# Altium project 1U 按键.PrjPcb
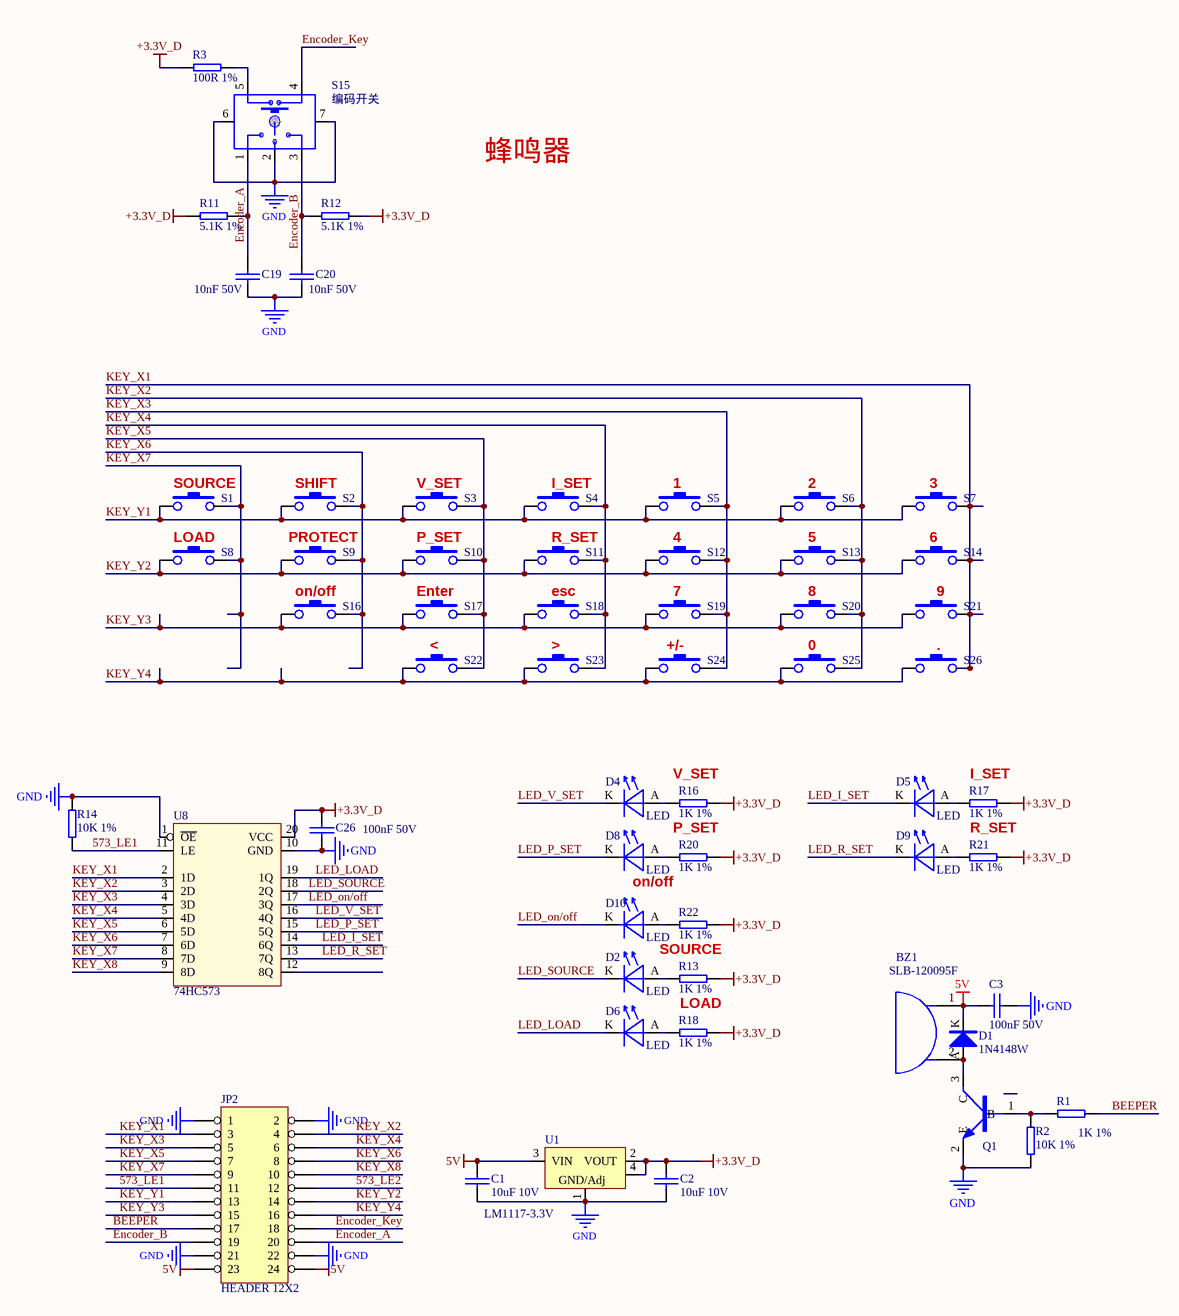
[diagram p0: 1U 按键.SchDoc]
1 sheet, 58 parts. Net scope: global (net labels, ports and power ports of the same name join across sheets).
Board file: 1U 按键.PcbDoc

## Sheet 1U 按键.SchDoc
size A3

### Parts
BZ1  SLB-120095F  [BEEP12]
C1  10uF 10V  [C0603]
C2  10uF 10V  [C0603]
C3  100nF 50V  [C0603]
C19  10nF 50V  [C0603]
C20  10nF 50V  [C0603]
C26  100nF 50V  [C0603]
D1  1N4148W  [SOD-123]
D2  LED  [LED1206]
D4  LED  [LED1206]
D5  LED  [LED1206]
D6  LED  [LED1206]
D8  LED  [LED1206]
D9  LED  [LED1206]
D10  LED  [LED1206]
JP2  HEADER 12X2  [FPC-SMD_P0.50-24P_H2.0]
Q1  S8050  [SOT-23]  (value not drawn)
R1  1K 1%  [R0603]
R2  10K 1%  [R0603]
R3  100R 1%  [R0603]
R11  5.1K 1%  [R0603]
R12  5.1K 1%  [R0603]
R13  1K 1%  [R0603]
R14  10K 1%  [R0603]
R16  1K 1%  [R0603]
R17  1K 1%  [R0603]
R18  1K 1%  [R0603]
R20  1K 1%  [R0603]
R21  1K 1%  [R0603]
R22  1K 1%  [R0603]
S1  SW-PB  [SW-SMD2]  (value not drawn)
S2  SW-PB  [SW-SMD3]  (value not drawn)
S3  SW-PB  [SW-SMD2]  (value not drawn)
S4  SW-PB  [SW-SMD2]  (value not drawn)
S5  SW-PB  [SW-SMD3]  (value not drawn)
S6  SW-PB  [SW-SMD3]  (value not drawn)
S7  SW-PB  [SW-SMD3]  (value not drawn)
S8  SW-PB  [SW-SMD2]  (value not drawn)
S9  SW-PB  [SW-SMD3]  (value not drawn)
S10  SW-PB  [SW-SMD2]  (value not drawn)
S11  SW-PB  [SW-SMD2]  (value not drawn)
S12  SW-PB  [SW-SMD3]  (value not drawn)
S13  SW-PB  [SW-SMD3]  (value not drawn)
S14  SW-PB  [SW-SMD3]  (value not drawn)
S15  编码开关  [EC-11]
S16  SW-PB  [SW-SMD2]  (value not drawn)
S17  SW-PB  [SW-SMD3]  (value not drawn)
S18  SW-PB  [SW-SMD3]  (value not drawn)
S19  SW-PB  [SW-SMD3]  (value not drawn)
S20  SW-PB  [SW-SMD3]  (value not drawn)
S21  SW-PB  [SW-SMD3]  (value not drawn)
S22  SW-PB  [SW-SMD3]  (value not drawn)
S23  SW-PB  [SW-SMD3]  (value not drawn)
S24  SW-PB  [SW-SMD3]  (value not drawn)
S25  SW-PB  [SW-SMD3]  (value not drawn)
S26  SW-PB  [SW-SMD3]  (value not drawn)
U1  LM1117-3.3V  [SOT-223]
U8  74HC573  [TSSOP-20]

### Nets
5V: BZ1.1 C1.1 C3.1 D1.K JP2.23 JP2.24 U1.3(VIN)
+3.3V_D: C2.1 C26.1 R3.1 R11.1 R12.2 R13.2 R16.2 R17.2 R18.2 R20.2 R21.2 R22.2 U1.2(VOUT) U1.4 U8.20(VCC)
GND: C1.2 C2.2 C3.2 C19.1 C20.1 C26.2 JP2.1 JP2.2 JP2.21 JP2.22 Q1.2(E) R2.1 R14.2 S15.2 S15.6 S15.7 U1.1(GND/Adj) U8.1(~{OE}) U8.10(GND)
573_LE1: JP2.11 R14.1 U8.11(LE)
573_LE2: JP2.12
BEEPER: JP2.17 R1.2
Encoder_A: C19.2 JP2.20 R11.2 S15.1
Encoder_B: C20.2 JP2.19 R12.1 S15.3
Encoder_Key: JP2.18 S15.4
KEY_X1: JP2.3 S7.2 S14.2 S21.2 S26.2 U8.2(1D)
KEY_X2: JP2.4 S6.2 S13.2 S20.2 S25.2 U8.3(2D)
KEY_X3: JP2.5 S5.2 S12.2 S19.2 S24.2 U8.4(3D)
KEY_X4: JP2.6 S4.2 S11.2 S18.2 S23.2 U8.5(4D)
KEY_X5: JP2.7 S3.2 S10.2 S17.2 S22.2 U8.6(5D)
KEY_X6: JP2.8 S2.2 S9.2 S16.2 U8.7(6D)
KEY_X7: JP2.9 S1.2 S8.2 U8.8(7D)
KEY_X8: JP2.10 U8.9(8D)
KEY_Y1: JP2.13 S1.1 S2.1 S3.1 S4.1 S5.1 S6.1 S7.1
KEY_Y2: JP2.14 S8.1 S9.1 S10.1 S11.1 S12.1 S13.1 S14.1
KEY_Y3: JP2.15 S16.1 S17.1 S18.1 S19.1 S20.1 S21.1
KEY_Y4: JP2.16 S22.1 S23.1 S24.1 S25.1 S26.1
LED_I_SET: D5.K U8.14(6Q)
LED_LOAD: D6.K U8.19(1Q)
LED_on/off: D10.K U8.17(3Q)
LED_P_SET: D8.K U8.15(5Q)
LED_R_SET: D9.K U8.13(7Q)
LED_SOURCE: D2.K U8.18(2Q)
LED_V_SET: D4.K U8.16(4Q)
NetBZ1_2: BZ1.2 D1.A Q1.3(C)
NetD2_A: D2.A R13.1
NetD4_A: D4.A R16.1
NetD5_A: D5.A R17.1
NetD6_A: D6.A R18.1
NetD8_A: D8.A R20.1
NetD9_A: D9.A R21.1
NetD10_A: D10.A R22.1
NetQ1_1: Q1.1(B) R1.1 R2.2
NetR3_2: R3.2 S15.5

Not connected (* = marked no-connect by the designer): U8 12(8Q)

### Notes on the sheet
- 蜂鸣器
- (near S1) SOURCE
- (near S2) SHIFT
- (near S3) V_SET
- (near S4) I_SET
- (near S5) 1
- (near S6) 2
- (near S7) 3
- LOAD
- PROTECT
- P_SET
- R_SET
- 4
- 5
- 6
- on/off
- Enter
- esc
- 7
- 8
- 9
- <
- >
- +/-
- 0
- .
- V_SET
- (near R17) I_SET
- SOURCE

### Library data of the parts
BZ1 = Buzzer: UNIT: 110101900023X; UNIT-TYPE: (CD)交流蜂鸣器Alternate Buzzer PS1440P02BT "TDK"牌(RoHS)
C1 C2 = 10uF 0603 10V: 贴片电容; Type: 10uF (106) ±10% 10V X5R; LCSC: C19702
C3 C19 C20 C26 = 100nF 0603 50V: 贴片电容; Type: 100nF (104) ±10% 50V X7R; LCSC: C14663
D1 = 1N4148W SOD-123: 二极管; Type: 1N4148W,SOD-123,75V,150mA; LCSC: C81598
Q1 = S8050 SOT-23: NPN; TYPE: S8050,SOT-23,Vce=25V; LCSC: C2150
R1 R13 R16-R18 R20-R22 = 1K 1% 0603: 贴片电阻; Type: 1K ±1% 0603; LCSC: C21190
R2 R14 = 10K 1% 0603: 贴片电阻; Type: 10K ±1% 0603; LCSC: C25804
R3 = 100R 1% 0603: 贴片电阻; Type: 100R ±1% 0603; LCSC: C22775
R11 R12 = 5.1K 1% 0603: 贴片电阻; Type: 5.1K ±1% 0603; LCSC: C23186
S15 = SW: UNIT: 110102600174X; UNIT-TYPE: (CD)编码开关/（带开关）/24P24AL22.5F7/增量型/13.2×12.4X22.5mm/24档(RoHS)
U1 = LM1117-3.3V SOT-223: 线性稳压; Type: LM1117-3.3V，SOT-223，3.3V; LCSC: C6186